# Altium project EBC2.PrjPCB
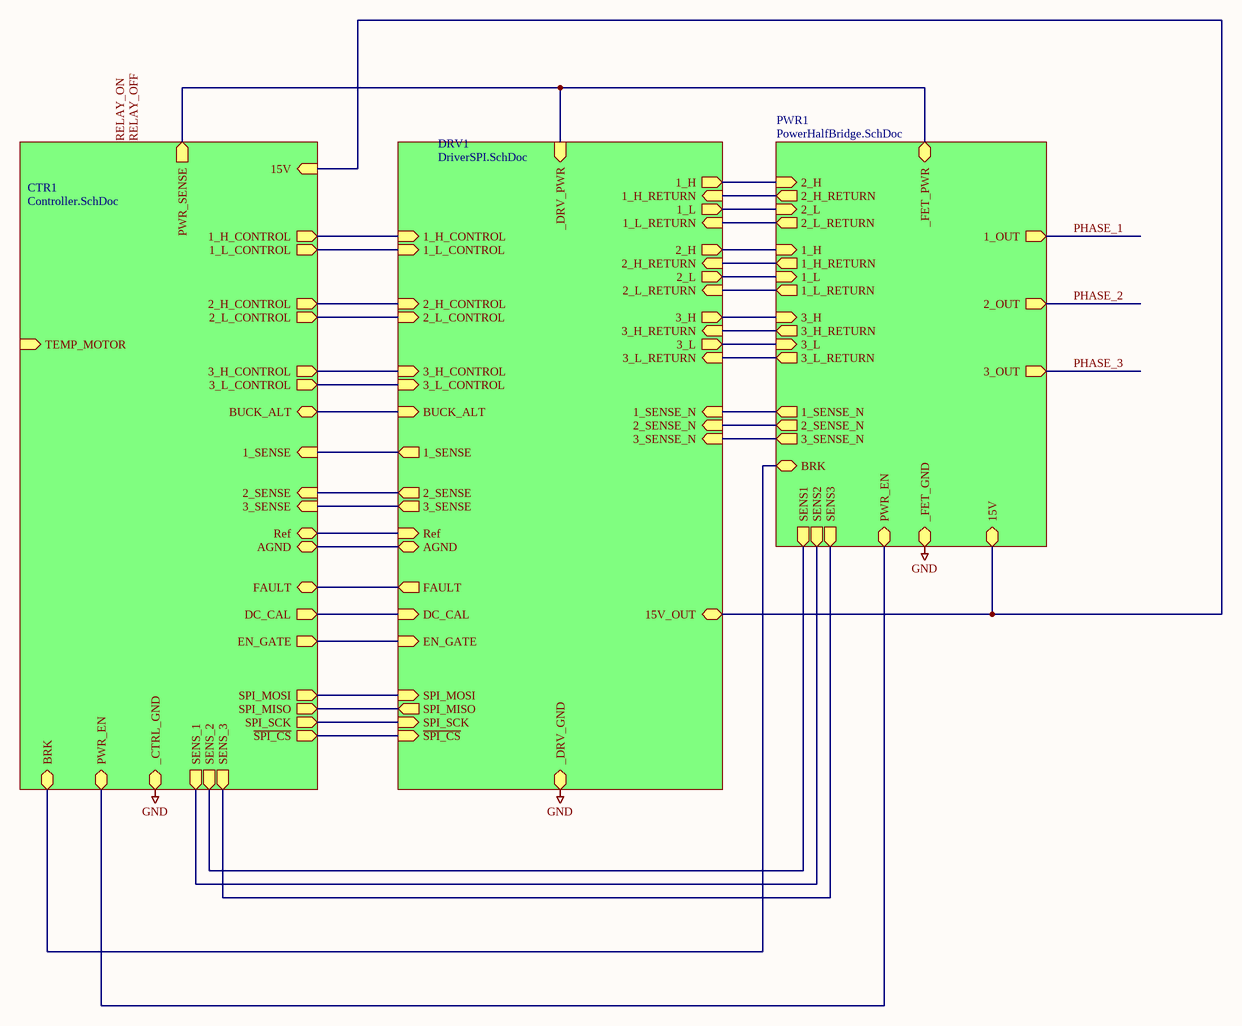
[diagram p0: Main.SchDoc]
4 sheets, 138 parts. Net scope: hierarchical (ports join the sheet entries above them; power ports are global).
Board file: EBC2.PcbDoc
Sheets:
  Main.SchDoc
    PWR1 = PowerHalfBridge.SchDoc
    DRV1 = DriverSPI.SchDoc
    CTR1 = Controller.SchDoc

## Sheet Main.SchDoc
size A3; PageSetup: Record=PageOptions|CenterHorizontal=True|CenterVertical=True|PrintScale=0.67|XCorrection=1.00|YCorrection=1.00|PrintKind=2|BorderSize=5000000|LeftOffset=0|BottomOffset=0|Orientation=2|PaperLength=2970|PaperWidth=2100|Scale=100|PaperSource=7|PrintQuality=300|MediaType=1|DitherType=2|PrintScaleMode=1|PaperKind=A4|PaperIndex=9; Scale: 1:1; DocumentType: Схема электрическая принципиальная; FirstReferrence: АБВГ.123456.001

### Sub-sheets
CTR1 = Controller.SchDoc: FAULT, 1_L_CONTROL (out), 2_L_CONTROL (out), 3_L_CONTROL (out), DC_CAL (out), SPI_SCK (out), PWR_SENSE (out), 3_H_CONTROL (out), 2_H_CONTROL (out), 1_H_CONTROL (out), SPI_MOSI (out), ~{SPI_CS} (out), 1_SENSE (in), 2_SENSE (in), 15V (in), EN_GATE (out), _CTRL_GND, Ref, AGND, SPI_MISO (out), SENS_1 (out), SENS_2 (out), SENS_3 (out), TEMP_MOTOR (in), BRK, 3_SENSE (in), BUCK_ALT, PWR_EN
DRV1 = DriverSPI.SchDoc: 2_H (out), 1_H (out), 3_H (out), 2_L (out), 1_L (out), 3_L (out), 2_SENSE_N (in), 1_SENSE_N (in), 3_SENSE_N (in), 2_H_RETURN (in), 2_L_RETURN (in), 1_H_RETURN (in), 3_H_RETURN (in), 1_L_RETURN (in), 3_L_RETURN (in), 2_H_CONTROL (in), 2_L_CONTROL (in), 1_H_CONTROL (in), 1_L_CONTROL (in), 3_H_CONTROL (in), 3_L_CONTROL (in), 1_SENSE (out), 2_SENSE (out), _DRV_PWR (in), _DRV_GND (bidir), Ref (in), AGND (bidir), 15V_OUT, FAULT (out), EN_GATE (in), DC_CAL (in), SPI_MOSI (in), SPI_MISO (out), ~{SPI_CS} (in), SPI_SCK (in), 3_SENSE (out), BUCK_ALT (in)
PWR1 = PowerHalfBridge.SchDoc: 1_H (in), 2_H (in), 3_H (in), 1_L (in), 2_L (in), 3_L (in), 1_SENSE_N (out), 2_SENSE_N (out), 3_SENSE_N (out), _FET_PWR, _FET_GND, 1_OUT (out), 2_OUT (out), 3_OUT (out), 1_H_RETURN (out), 1_L_RETURN (out), 2_H_RETURN (out), 3_H_RETURN (out), 2_L_RETURN (out), 3_L_RETURN (out), SENS1 (out), SENS2 (out), SENS3 (out), 15V, BRK, PWR_EN

### Nets
GND: sheet PWR1/_FET_GND, sheet DRV1/_DRV_GND, sheet CTR1/_CTRL_GND  [project net _CTRL_GND]
1_H_CONTROL: sheet DRV1/1_H_CONTROL, sheet CTR1/1_H_CONTROL
1_L_CONTROL: sheet DRV1/1_L_CONTROL, sheet CTR1/1_L_CONTROL
2_L_CONTROL: sheet DRV1/2_L_CONTROL, sheet CTR1/2_L_CONTROL
3_L_CONTROL: sheet DRV1/3_L_CONTROL, sheet CTR1/3_L_CONTROL
_AGND: sheet DRV1/AGND, sheet CTR1/AGND
_REF: sheet DRV1/Ref, sheet CTR1/Ref
BRK: sheet PWR1/BRK, sheet CTR1/BRK
BUCK: sheet PWR1/15V, sheet DRV1/15V_OUT, sheet CTR1/15V
EN_GATE: sheet DRV1/EN_GATE, sheet CTR1/EN_GATE
FAULT: sheet DRV1/FAULT, sheet CTR1/FAULT
PHASE_1: sheet PWR1/1_OUT, sheet PWR1/1_H_RETURN, sheet DRV1/2_H_RETURN
PHASE_2: sheet PWR1/2_OUT, sheet PWR1/2_H_RETURN, sheet DRV1/1_H_RETURN
PHASE_3: sheet PWR1/3_OUT, sheet PWR1/3_H_RETURN, sheet DRV1/3_H_RETURN
PWR_EN: sheet PWR1/PWR_EN, sheet CTR1/PWR_EN
~{SPI_CS}: sheet DRV1/~{SPI_CS}, sheet CTR1/~{SPI_CS}
SPI_MOSI: sheet DRV1/SPI_MOSI, sheet CTR1/SPI_MOSI
SPI_SCK: sheet DRV1/SPI_SCK, sheet CTR1/SPI_SCK
UH_P: sheet PWR1/1_H, sheet DRV1/2_H
UL_N: sheet PWR1/1_L_RETURN, sheet DRV1/2_L_RETURN
UL_P: sheet PWR1/1_L, sheet DRV1/2_L
VH_P: sheet PWR1/2_H, sheet DRV1/1_H
Vin: sheet PWR1/_FET_PWR, sheet DRV1/_DRV_PWR, sheet CTR1/PWR_SENSE
VL_N: sheet PWR1/2_L_RETURN, sheet DRV1/1_L_RETURN
VL_P: sheet PWR1/2_L, sheet DRV1/1_L
WH_P: sheet PWR1/3_H, sheet DRV1/3_H
WL_N: sheet PWR1/3_L_RETURN, sheet DRV1/3_L_RETURN
WL_P: sheet PWR1/3_L, sheet DRV1/3_L
NetC212_1: sheet DRV1/BUCK_ALT, sheet CTR1/BUCK_ALT
NetIC100_9: sheet PWR1/SENS2, sheet CTR1/SENS_1
NetIC100_10: sheet PWR1/SENS1, sheet CTR1/SENS_2
NetIC100_11: sheet PWR1/SENS3, sheet CTR1/SENS_3
NetIC100_14: sheet DRV1/3_SENSE, sheet CTR1/3_SENSE
NetIC100_15: sheet DRV1/2_SENSE, sheet CTR1/2_SENSE
NetIC100_16: sheet DRV1/1_SENSE, sheet CTR1/1_SENSE
NetIC200_12: sheet PWR1/1_SENSE_N, sheet DRV1/1_SENSE_N
NetIC200_13: sheet PWR1/2_SENSE_N, sheet DRV1/2_SENSE_N
NetIC200_22: sheet PWR1/3_SENSE_N, sheet DRV1/3_SENSE_N
NetIC200_29: sheet DRV1/SPI_MISO, sheet CTR1/SPI_MISO
NetIC200_34: sheet DRV1/DC_CAL, sheet CTR1/DC_CAL
NetIC200_39: sheet DRV1/2_H_CONTROL, sheet CTR1/2_H_CONTROL
NetIC200_41: sheet DRV1/3_H_CONTROL, sheet CTR1/3_H_CONTROL

### Notes on the sheet
- Labels drawn without touching a wire or pin: RELAY_OFF, RELAY_ON
- Title
- Size:
- Date:
- A3
- Number:
- Time:
- Revision:
- Sheet
- of
- File:

## Sheet PowerHalfBridge.SchDoc
size A3
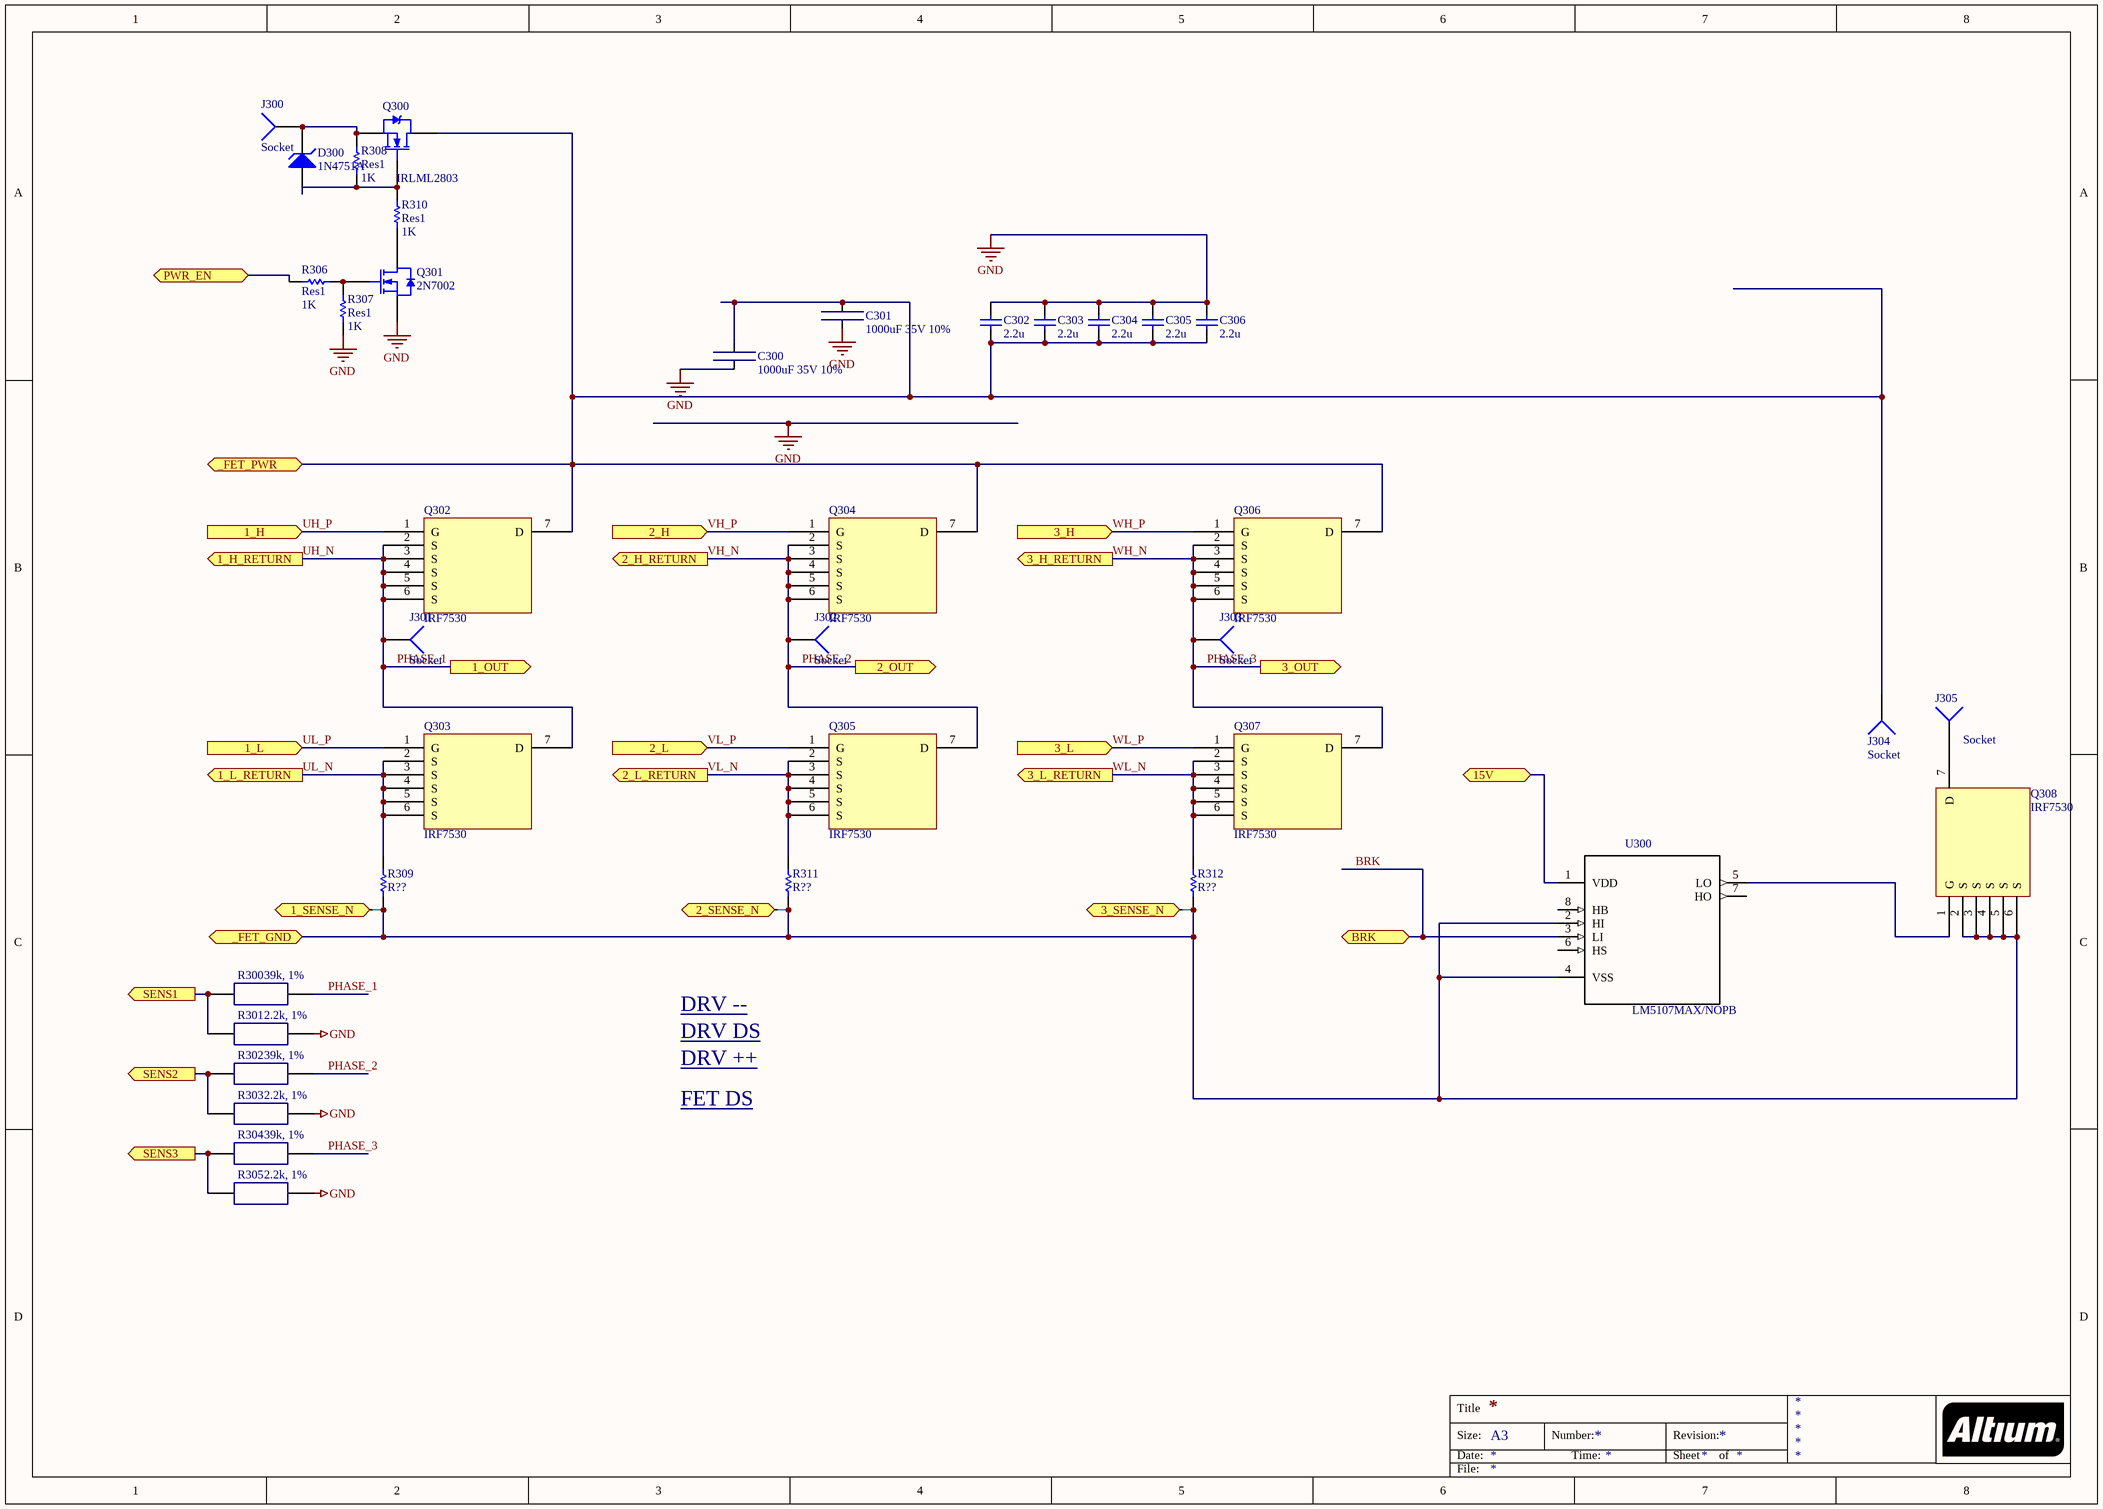
[diagram p1: PowerHalfBridge.SchDoc]

### Parts
C300  1000uF 35V 10%  [CAP_1mF_63V_SMD]
C301  1000uF 35V 10%  [CAP_1mF_63V_SMD]
C302  2.2u  [1210]
C303  2.2u  [1210]
C304  2.2u  [1210]
C305  2.2u  [1210]
C306  2.2u  [1210]
D300  1N4751A  [SOD80C]
J300  Socket  [PIN1]
J301  Socket  [PIN1]
J302  Socket  [PIN1]
J303  Socket  [PIN1]
J304  Socket  [PIN1]
J305  Socket  [PIN1]
NT300  NET_TIE  [NET_TIE_20mil]  (value not drawn)  (net tie, no BOM)
NT301  NET_TIE  [NET_TIE_20mil]  (value not drawn)  (net tie, no BOM)
NT302  NET_TIE  [NET_TIE_20mil]  (value not drawn)  (net tie, no BOM)
Q300  IRLML2803  [SOT-23]
Q301  2N7002  [SOT-23]
Q302  IRF7530  [D2PAK-7]
Q303  IRF7530  [D2PAK-7]
Q304  IRF7530  [D2PAK-7]
Q305  IRF7530  [D2PAK-7]
Q306  IRF7530  [D2PAK-7]
Q307  IRF7530  [D2PAK-7]
Q308  IRF7530  [D2PAK-7]
R300  39k, 1%  [0805x]
R301  2.2k, 1%  [0805x]
R302  39k, 1%  [0805x]
R303  2.2k, 1%  [0805x]
R304  39k, 1%  [0805x]
R305  2.2k, 1%  [0805x]
R306  Res1  value 1K  [0603x]
R307  Res1  value 1K  [0603x]
R308  Res1  value 1K  [0603x]
R309  value R??  [2512]  (hidden comment: Res1)
R310  Res1  value 1K  [0603x]
R311  value R??  [2512]  (hidden comment: Res1)
R312  value R??  [2512]  (hidden comment: Res1)
U300  LM5107MAX/NOPB  [SOIC127P620X175-8N]

### Ports
1_H (in), 1_H_RETURN (out), 1_L (in), 1_L_RETURN (out), 1_OUT (out), 1_SENSE_N (out), 2_H (in), 2_H_RETURN (out), 2_L (in), 2_L_RETURN (out), 2_OUT (out), 2_SENSE_N (out), 3_H (in), 3_H_RETURN (out), 3_L (in), 3_L_RETURN (out), 3_OUT (out), 3_SENSE_N (out), 15V, _FET_GND, _FET_PWR, BRK, PWR_EN, SENS1 (out), SENS2 (out), SENS3 (out)

### Nets
GND: C300.2 C301.1 C302.2 C303.2 C304.2 C305.2 C306.2 NT300.2 NT301.2 NT302.2 Q301.2(S) Q308.2(S) Q308.3(S) Q308.4(S) Q308.5(S) Q308.6(S) R301.2 R303.2 R305.2 R307.2 R309.1 R311.1 R312.1 U300.2(HI) U300.4(VSS) ; port _FET_GND  [project net _CTRL_GND]
BRK: U300.3(LI) ; port BRK
BUCK: U300.1(VDD) ; port 15V
PHASE_1: J301.1 Q302.2(S) Q302.3(S) Q302.4(S) Q302.5(S) Q302.6(S) Q303.7(D) R300.2 ; port 1_H_RETURN, port 1_OUT  [also labelled UH_N]
PHASE_2: J302.1 Q304.2(S) Q304.3(S) Q304.4(S) Q304.5(S) Q304.6(S) Q305.7(D) R302.2 ; port 2_H_RETURN, port 2_OUT  [also labelled VH_N]
PHASE_3: J303.1 Q306.2(S) Q306.3(S) Q306.4(S) Q306.5(S) Q306.6(S) Q307.7(D) R304.2 ; port 3_H_RETURN, port 3_OUT  [also labelled WH_N]
PWR_EN: R306.2 ; port PWR_EN
UH_P: Q302.1(G) ; port 1_H
UL_N: Q303.2(S) Q303.3(S) Q303.4(S) Q303.5(S) Q303.6(S) R309.2 ; port 1_L_RETURN
UL_P: Q303.1(G) ; port 1_L
VH_P: Q304.1(G) ; port 2_H
Vin: C300.1 C301.2 C302.1 C303.1 C304.1 C305.1 C306.1 J304.1 Q300.3(D) Q302.7(D) Q304.7(D) Q306.7(D) ; port _FET_PWR
VL_N: Q305.2(S) Q305.3(S) Q305.4(S) Q305.5(S) Q305.6(S) R311.2 ; port 2_L_RETURN
VL_P: Q305.1(G) ; port 2_L
WH_P: Q306.1(G) ; port 3_H
WL_N: Q307.2(S) Q307.3(S) Q307.4(S) Q307.5(S) Q307.6(S) R312.2 ; port 3_L_RETURN
WL_P: Q307.1(G) ; port 3_L
NetD300_1: D300.1(A) Q300.1(G) R308.1 R310.2
NetD300_2: D300.2(K) J300.1 Q300.2(S) R308.2
NetIC100_9: R302.1 R303.1 ; port SENS2
NetIC100_10: R300.1 R301.1 ; port SENS1
NetIC100_11: R304.1 R305.1 ; port SENS3
NetIC200_12: NT300.1 ; port 1_SENSE_N
NetIC200_13: NT301.1 ; port 2_SENSE_N
NetIC200_22: NT302.1 ; port 3_SENSE_N
NetJ305_1: J305.1 Q308.7(D)
NetQ301_1: Q301.1(G) R306.1 R307.1
NetQ301_3: Q301.3(D) R310.1
NetQ308_1: Q308.1(G) U300.5(LO)

Not connected (* = marked no-connect by the designer): U300 6(HS) 7(HO) 8(HB)

### Notes on the sheet
- DRV DS <http://www.ti.com/lit/ds/symlink/drv8323r.pdf>
- DRV -- <http://www.ti.com/product/drv8323r>
- DRV ++ <http://www.ti.com/tool/tida-00774>
- FET DS <https://www.infineon.com/dgdl/Infineon-IPB039N10N3G-DS-v02_03-en.pdf?fileId=db3a30431ce5fb52011d1ed1fd3915e0>
- Title
- Size:
- Date:
- A3
- Number:
- Time:
- Revision:
- Sheet
- of
- File:

### Library data of the parts
C300 C301 = Ceramic Chip Capacitor: Value: CAP CER 0.022UF 50V X7R 0402; Order Number: GRM155R71H223KA12D; Distributor: Murata Electronics; Package: 0402
C302-C306 = Cap: Capacitor; Value: 100pF; Published: 8-Jun-2000; LatestRevisionDate: 17-Jul-2002; LatestRevisionNote: Re-released for DXP Platform.; PackageReference: RAD-0.3; Publisher: Altium Limited; PackageDescription: Radial Cap, Thru-Hole; 2 Leads; 0.3 in Pin Spacing
D300 = 1N4751A: 1W Zener Diode; Published: 8-Jun-2000; LatestRevisionDate: 17-Jul-2002; LatestRevisionNote: Re-released for DXP Platform.; DatasheetDocument: REV. H; PackageReference: DO-41; Publisher: Altium Limited; Code_JEDEC: DO-204-AL; ComponentLink1Description: Manufacturer Link; ComponentLink1URL: http://www.vishay.com/; ComponentLink2Description: Datasheet; ComponentLink2URL: http://www.vishay.com/docs/85816/85816.pdf
NT300-NT302 = Net tie
Q300 = IRLML2803: HEXFET Power MOSFET; Published: 8-Jun-2000; LatestRevisionDate: 20-Nov-2009; LatestRevisionNote: IPC-7351 Footprint Added.; DatasheetVersion: Aug-1997; PackageReference: SOT-23; Publisher: Altium Limited; PackageDescription: 3-Pin SOT-23 Package 0.95 mm Pitch, 2.3 mm Lead Span; ComponentLink1Description: Manufacturer Link; ComponentLink1URL: http://www.irf.com/; ComponentLink2Description: Datasheet; ComponentLink2URL: http://www.irf.com/product-info/datasheets/data/irlml2803.pdf
Q301 = 2N7002: N-channel Enhancement Mode Field-effect Transistor; Published: 17-Sep-2003; LatestRevisionDate: 12-Dec-2006; LatestRevisionNote: IPC-7351 Footprint Added.; DatasheetVersion: 27-Jul-2000; PackageVersion: May-1999; PackageReference: SOT23; Publisher: Altium Limited; PackageDescription: 3-Pin SOT-23 Package 0.95 mm Pitch, 2.3 mm Lead Span; ComponentLink1Description: Manufacturer Link; ComponentLink1URL: http://www.semiconductors.philips.com/; ComponentLink2Description: Datasheet; ComponentLink2URL: http://www.semiconductors.philips.com/acrobat/datasheets/2N7002_4.pdf
R300 R302 R304 = SMD: Order Number: ERJ-3EKF3902V; Value: 39k, 1%; Package: RESC1608X05N(0603); Distributor: Panasonic
R301 R303 R305 = SMD: Order Number: ERJ-3EKF2201V; Value: 2.2k, 1%; Package: RESC1608X05N(0603); Distributor: Panasonic
R306-R312 = Res1: Resistor; Published: 8-Jun-2000; LatestRevisionDate: 17-Jul-2002; LatestRevisionNote: Re-released for DXP Platform.; PackageReference: AXIAL-0.3; Publisher: Altium Limited; PackageDescription: Axial Device, Thru-Hole; 2 Leads; 0.3 in Pin Spacing
U300 = LM5107MAX/NOPB: IC DVR HALF-BRIDGE HV 8-SOIC; MF: Texas Instruments; Availability: Good; Package: SOIC-8 Texas Instruments; MP: LM5107MAX/NOPB; Price: 1.38 USD; Value: *
J300-J305 = Socket: LatestRevisionDate: 17-Jul-2002; LatestRevisionNote: Re-released for DXP Platform.; Publisher: Altium Limited

## Sheet DriverSPI.SchDoc
size A3
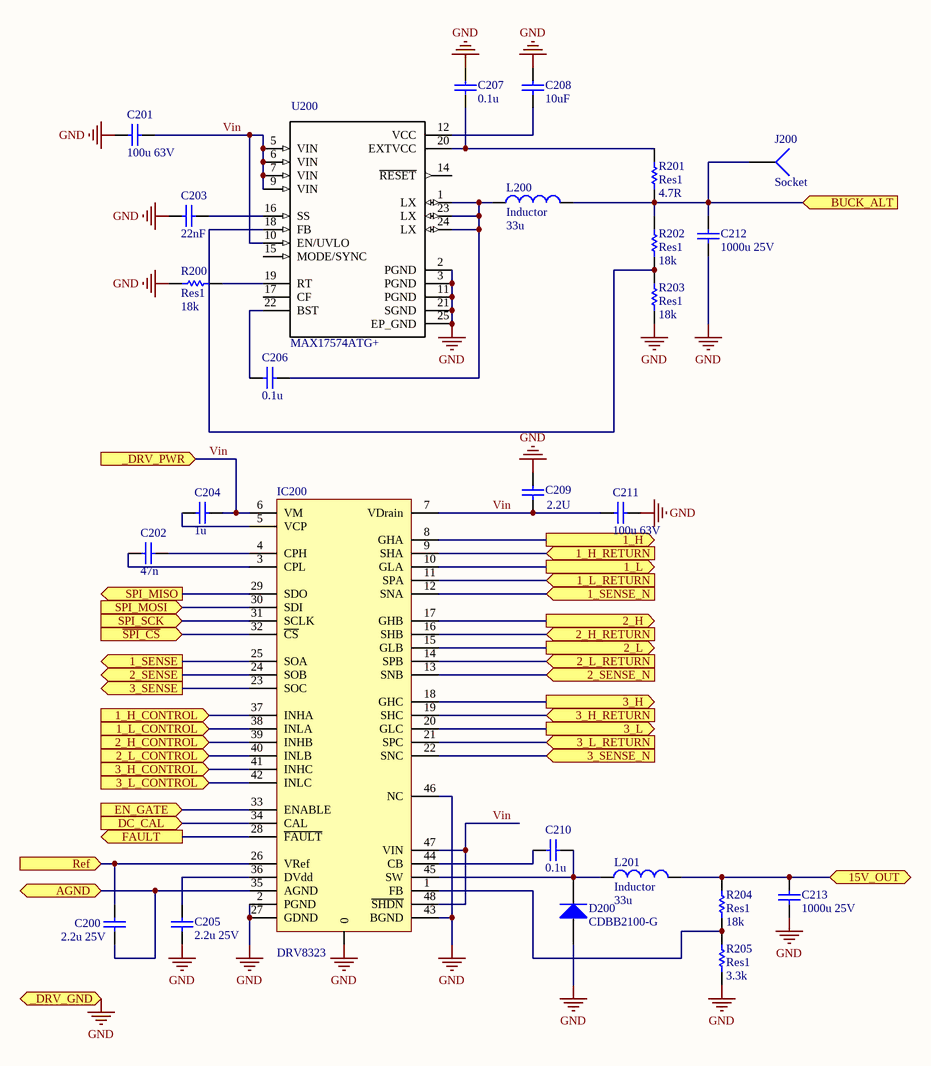
[diagram p2: DriverSPI.SchDoc]

### Parts
C200  2.2u 25V  [1206x]
C201  100u 63V  [CAP_ELEC_10mm]
C202  47n  [0603x]
C203  22nF  [0603x]
C204  1u  [0805x]
C205  2.2u 25V  [1206x]
C206  0.1u  [0603x]
C207  0.1u  [0603x]
C208  10uF  [1206x]
C209  2.2U  [1210]
C210  0.1u  [0603x]
C211  100u 63V  [CAP_ELEC_10mm]
C212  1000u 25V  [CAP_ELEC_10mm]
C213  1000u 25V  [CAP_ELEC_10mm]
D200  CDBB2100-G  [SMB_real]
IC200  DRV8323  [PWQFN-48]
J200  Socket  [PIN1]
L200  Inductor  value 33u  [DR74]
L201  Inductor  value 33u  [DR74]
R200  Res1  value 18k  [0603x]
R201  Res1  value 4.7R  [0603x]
R202  Res1  value 18k  [0603x]
R203  Res1  value 18k  [0603x]
R204  Res1  value 18k  [0603x]
R205  Res1  value 3.3k  [0603x]
U200  MAX17574ATG+  [QFN50P500X400X80-25N]

### Ports
1_H (out), 1_H_CONTROL (in), 1_H_RETURN (in), 1_L (out), 1_L_CONTROL (in), 1_L_RETURN (in), 1_SENSE (out), 1_SENSE_N (in), 2_H (out), 2_H_CONTROL (in), 2_H_RETURN (in), 2_L (out), 2_L_CONTROL (in), 2_L_RETURN (in), 2_SENSE (out), 2_SENSE_N (in), 3_H (out), 3_H_CONTROL (in), 3_H_RETURN (in), 3_L (out), 3_L_CONTROL (in), 3_L_RETURN (in), 3_SENSE (out), 3_SENSE_N (in), 15V_OUT, _DRV_GND (bidir), _DRV_PWR (in), AGND (bidir), BUCK_ALT (in), DC_CAL (in), EN_GATE (in), FAULT (out), Ref (in), SPI_MISO (out), SPI_MOSI (in), SPI_SCK (in), ~{SPI_CS} (in)

### Nets
GND: C201.2 C203.1 C205.1 C207.2 C208.2 C209.2 C211.1 C212.2 C213.2 D200.1(A) IC200.0 IC200.2(PGND) IC200.27(GDND) IC200.43(BGND) IC200.46(NC) R200.2 R203.1 R205.1 U200.2(PGND) U200.3(PGND) U200.11(PGND) U200.21(SGND) U200.25(EP_GND) ; port _DRV_GND  [project net _CTRL_GND]
1_H_CONTROL: IC200.37(INHA) ; port 1_H_CONTROL
1_L_CONTROL: IC200.38(INLA) ; port 1_L_CONTROL
2_L_CONTROL: IC200.40(INLB) ; port 2_L_CONTROL
3_L_CONTROL: IC200.42(INLC) ; port 3_L_CONTROL
_AGND: C200.1 IC200.35(AGND) ; port AGND
_REF: C200.2 IC200.26(VRef) ; port Ref
BUCK: C213.1 L201.2 R204.2 ; port 15V_OUT
EN_GATE: IC200.33(ENABLE) ; port EN_GATE
FAULT: IC200.28(~{FAULT}) ; port FAULT
PHASE_1: IC200.16(SHB) ; port 2_H_RETURN
PHASE_2: IC200.9(SHA) ; port 1_H_RETURN
PHASE_3: IC200.19(SHC) ; port 3_H_RETURN
~{SPI_CS}: IC200.32(~{CS}) ; port ~{SPI_CS}
SPI_MOSI: IC200.30(SDI) ; port SPI_MOSI
SPI_SCK: IC200.31(SCLK) ; port SPI_SCK
UH_P: IC200.17(GHB) ; port 2_H
UL_N: IC200.14(SPB) ; port 2_L_RETURN
UL_P: IC200.15(GLB) ; port 2_L
VH_P: IC200.8(GHA) ; port 1_H
Vin: C201.1 C204.2 C209.1 C211.2 IC200.6(VM) IC200.7(VDrain) IC200.47(VIN) IC200.48(~{SHDN}) U200.5(VIN) U200.6(VIN) U200.7(VIN) U200.9(VIN) U200.10(EN/UVLO) ; port _DRV_PWR
VL_N: IC200.11(SPA) ; port 1_L_RETURN
VL_P: IC200.10(GLA) ; port 1_L
WH_P: IC200.18(GHC) ; port 3_H
WL_N: IC200.21(SPC) ; port 3_L_RETURN
WL_P: IC200.20(GLC) ; port 3_L
NetC202_1: C202.1 IC200.3(CPL)
NetC202_2: C202.2 IC200.4(CPH)
NetC203_2: C203.2 U200.16(SS)
NetC204_1: C204.1 IC200.5(VCP)
NetC205_2: C205.2 IC200.36(DVdd)
NetC206_1: C206.1 U200.22(BST)
NetC206_2: C206.2 L200.1 U200.1(LX) U200.23(LX) U200.24(LX)
NetC207_1: C207.1 R201.1 U200.20(EXTVCC)
NetC208_1: C208.1 U200.12(VCC)
NetC210_1: C210.1 IC200.44(CB)
NetC210_2: C210.2 D200.2(K) IC200.45(SW) L201.1
NetC212_1: C212.1 J200.1 L200.2 R201.2 R202.2 ; port BUCK_ALT
NetIC100_14: IC200.23(SOC) ; port 3_SENSE
NetIC100_15: IC200.24(SOB) ; port 2_SENSE
NetIC100_16: IC200.25(SOA) ; port 1_SENSE
NetIC200_1: IC200.1(FB) R204.1 R205.2
NetIC200_12: IC200.12(SNA) ; port 1_SENSE_N
NetIC200_13: IC200.13(SNB) ; port 2_SENSE_N
NetIC200_22: IC200.22(SNC) ; port 3_SENSE_N
NetIC200_29: IC200.29(SDO) ; port SPI_MISO
NetIC200_34: IC200.34(CAL) ; port DC_CAL
NetIC200_39: IC200.39(INHB) ; port 2_H_CONTROL
NetIC200_41: IC200.41(INHC) ; port 3_H_CONTROL
NetR200_1: R200.1 U200.19(RT)
NetR202_1: R202.1 R203.2 U200.18(FB)

Not connected (* = marked no-connect by the designer): U200 14(~{RESET}) 15(MODE/SYNC) 17(CF)

### Notes on the sheet
- Title
- Size:
- Date:
- A3
- Number:
- Time:
- Revision:
- Sheet
- of
- File:

### Library data of the parts
C200-C213 = Cap: Capacitor; Value: 100pF; Published: 8-Jun-2000; LatestRevisionDate: 17-Jul-2002; LatestRevisionNote: Re-released for DXP Platform.; PackageReference: RAD-0.3; Publisher: Altium Limited; PackageDescription: Radial Cap, Thru-Hole; 2 Leads; 0.3 in Pin Spacing
D200 = Diode: Default Diode; Published: 8-Jun-2000; LatestRevisionDate: 17-Jul-2002; LatestRevisionNote: Re-released for DXP Platform.; PackageVersion: Sep-1996; PackageReference: SMC; Publisher: Altium Limited; PackageDescription: DO-214-AB/SMC; 2 C-Bend Leads; Body 7.9 x 5.9 mm, inc. leads (LxW); Code_JEDEC: DO-214-AB
L200 L201 = Inductor: Code_IEC: 1005; Published: 8-Jun-2000; LatestRevisionDate: 29-May-2009; LatestRevisionNote: IPC-7351 Footprint Added.; PackageReference: 0402-A; Publisher: Altium Limited; PackageDescription: Chip Inductor; Code_JEITA: 0402
R200-R205 = Res1: Resistor; Published: 8-Jun-2000; LatestRevisionDate: 17-Jul-2002; LatestRevisionNote: Re-released for DXP Platform.; PackageReference: AXIAL-0.3; Publisher: Altium Limited; PackageDescription: Axial Device, Thru-Hole; 2 Leads; 0.3 in Pin Spacing
U200 = MAX17574ATG+: IC REG BUCK ADJ 3A SYNC 24TQFN; MF: Maxim Integrated; MP: MAX17574ATG+; Package: TQFN-24 Maxim Integrated; Digi-Key_Part_Number: MAX17574ATG+-ND; Digi-Key_Purchase_URL: https://www.digikey.com/product-detail/en/maxim-integrated/MAX17574ATG-/MAX17574ATG--ND/6579157?WT.z_cid=ref_snapeda&utm_source=snapeda&utm_medium=aggregator&utm_campaign=buynow; Value: *
J200 = Socket: LatestRevisionDate: 17-Jul-2002; LatestRevisionNote: Re-released for DXP Platform.; Publisher: Altium Limited

## Sheet Controller.SchDoc
size A2
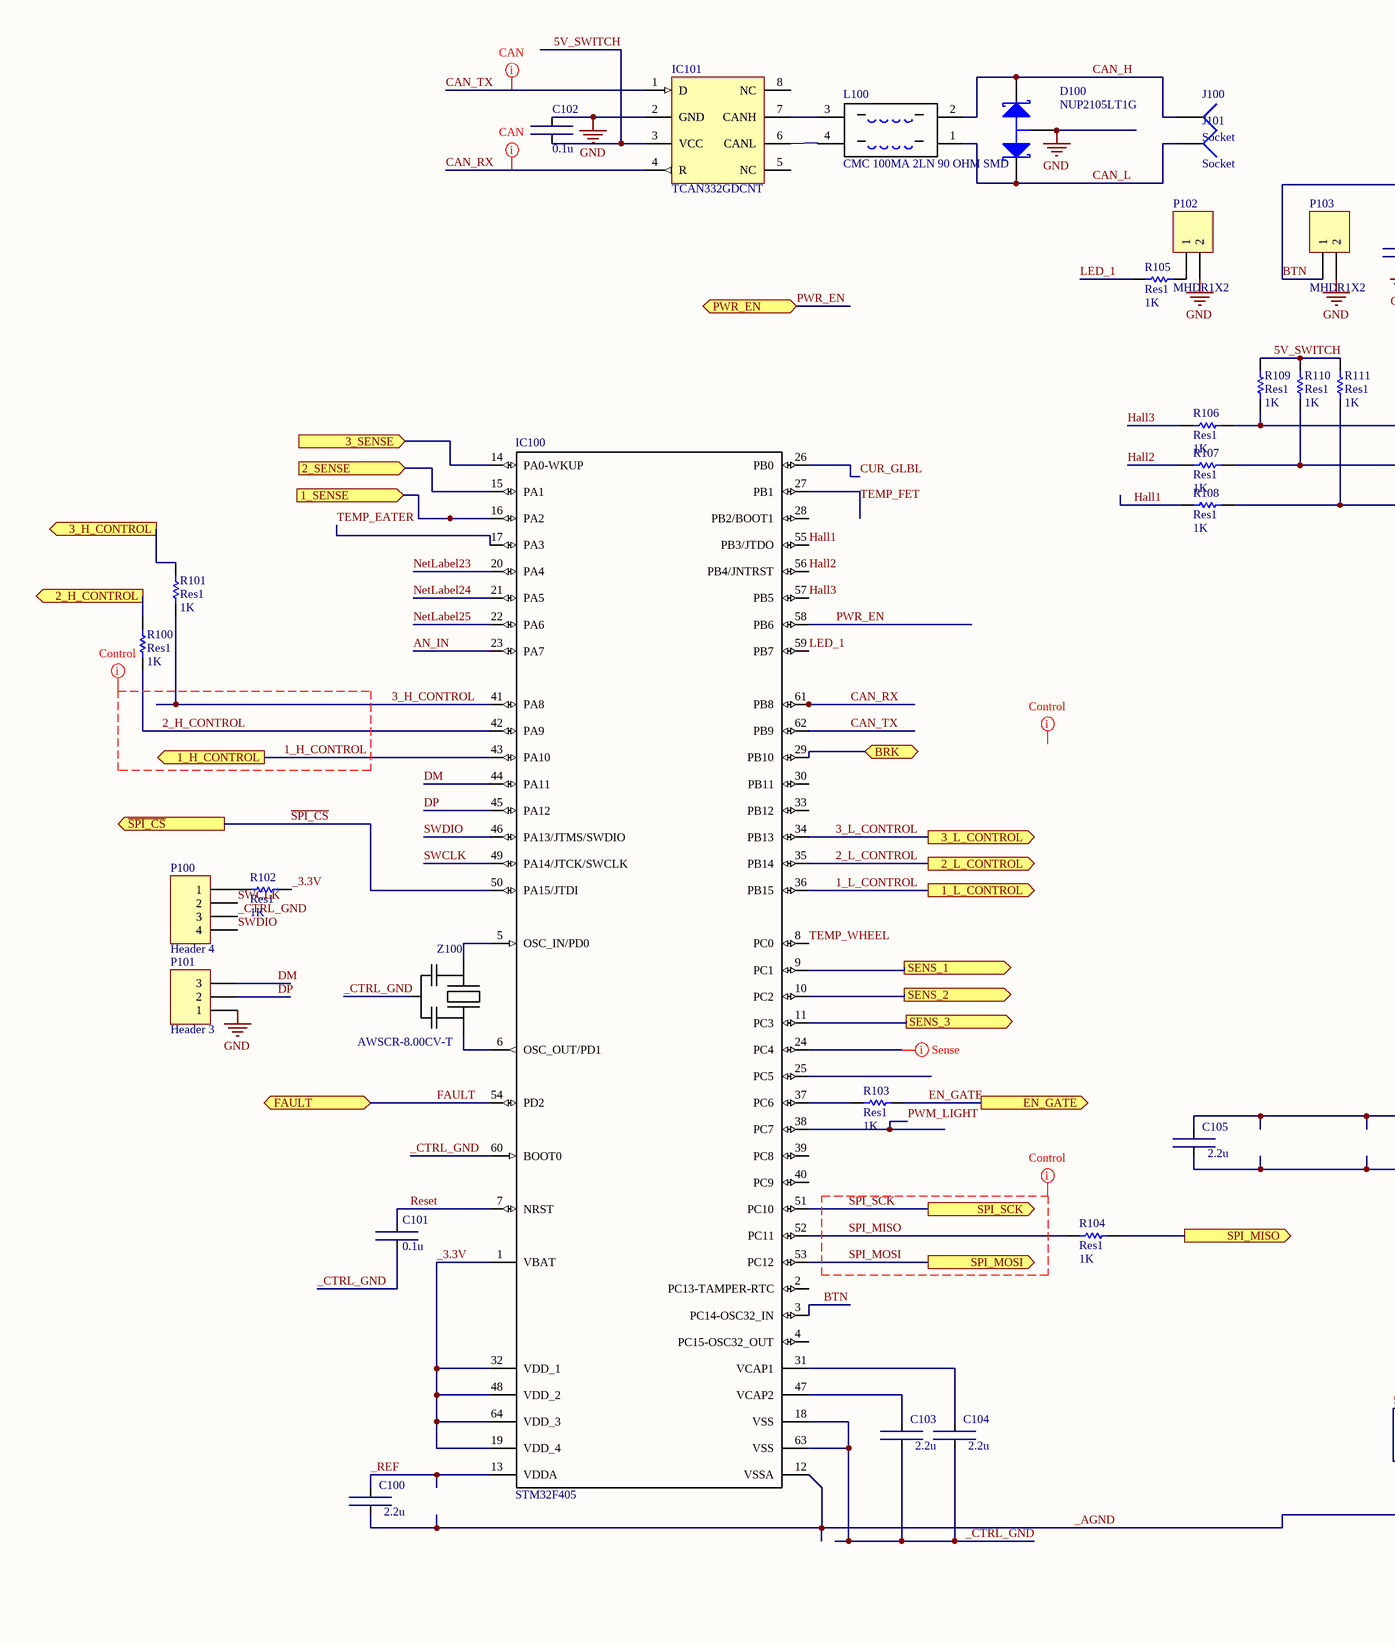
[diagram p3: Controller.SchDoc, left]
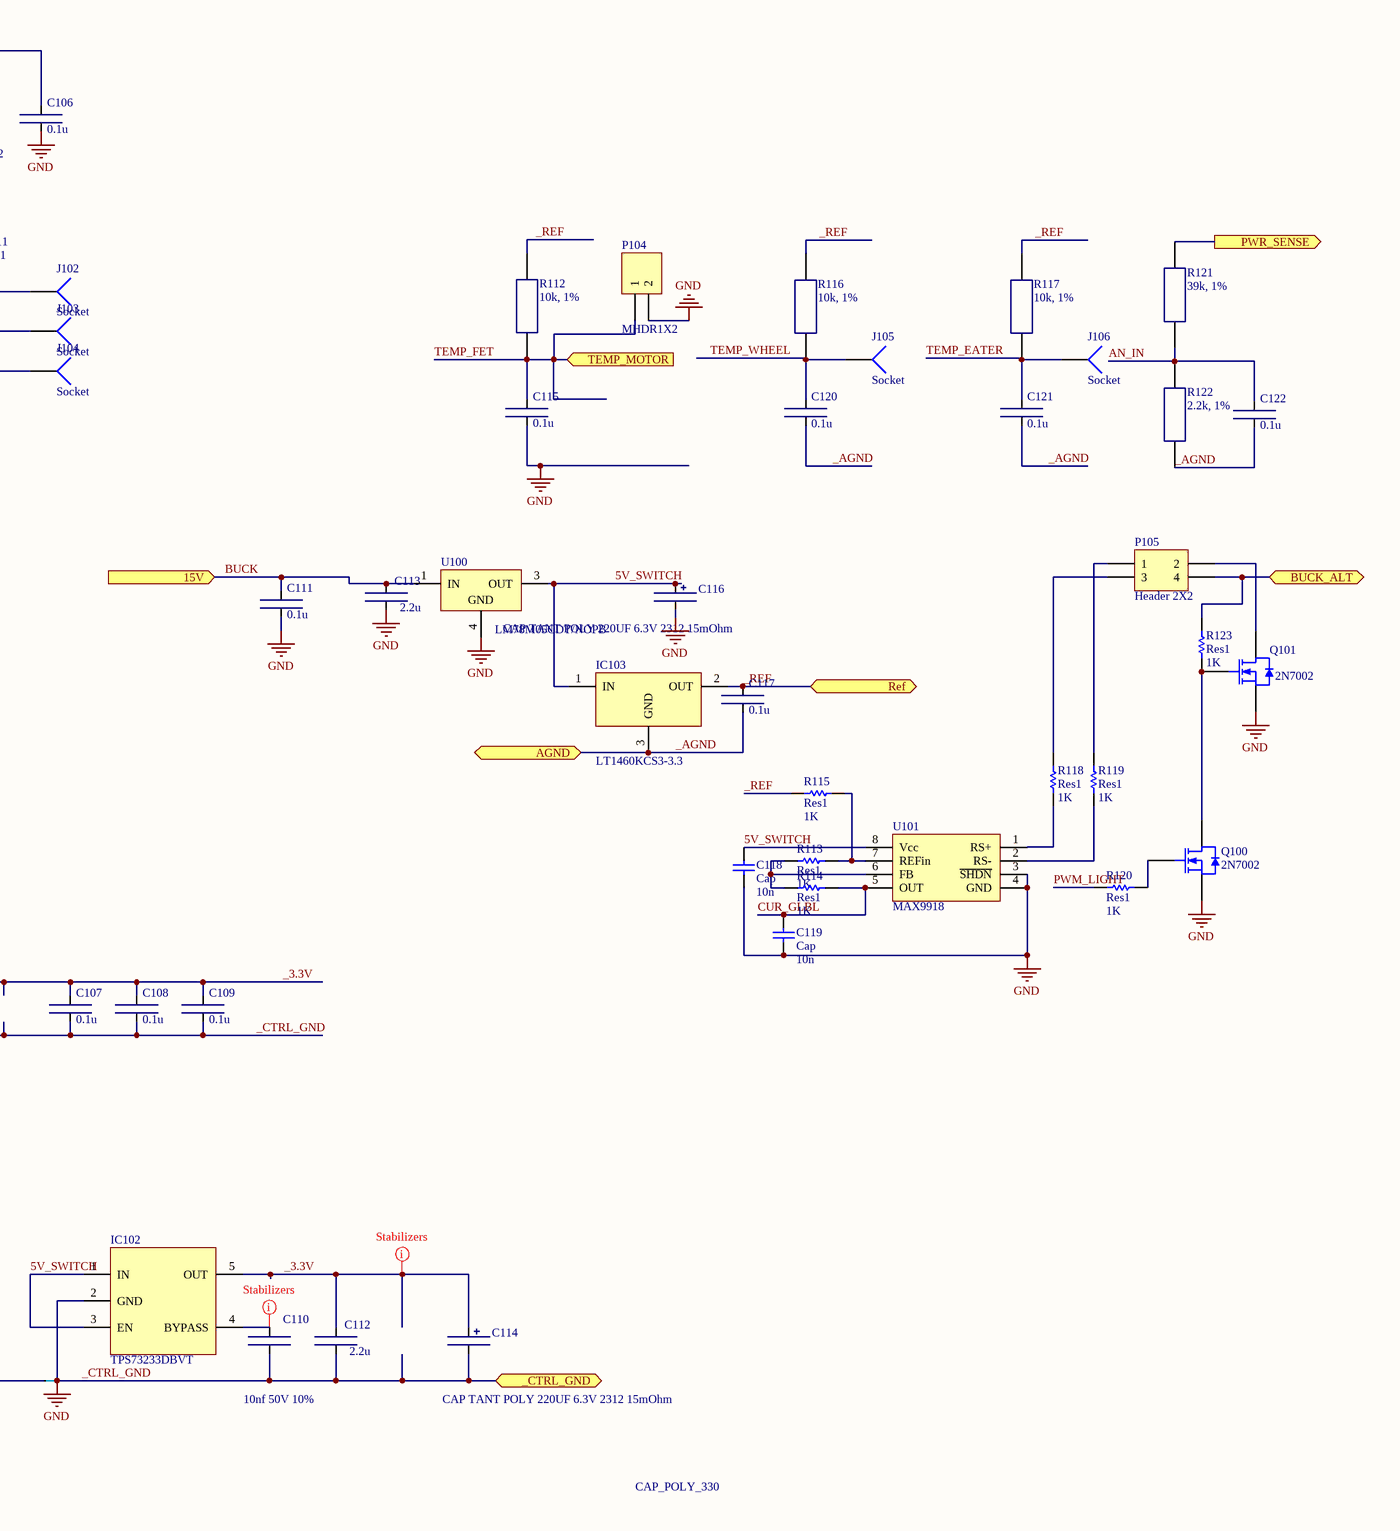
[diagram p4: Controller.SchDoc, right]

### Parts
C100  2.2u  [0603x]
C101  0.1u  [CAPC1608X08N(0603)]
C102  0.1u  [0603x]
C103  2.2u  [CAPC1608X08N(0603)]
C104  2.2u  [0603x]
C105  2.2u  [CAPC1608X08N(0603)]
C106  0.1u  [0603x]
C107  0.1u  [0603x]
C108  0.1u  [CAPC1608X08N(0603)]
C109  0.1u  [CAPC1608X08N(0603)]
C110  10nf 50V 10%  [0603x]
C111  0.1u  [ERA-0603]
C112  2.2u  [0603x]
C113  2.2u  [0603x]
C114  CAP TANT POLY 220UF 6.3V 2312 15mOhm  [CAP_POLY_330]
C115  0.1u  [0603x]
C116  CAP TANT POLY 220UF 6.3V 2312 15mOhm  [CAP_POLY_330]
C117  0.1u  [0603x]
C118  Cap  value 10n  [0603x]
C119  Cap  value 10n  [0603x]
C120  0.1u  [0603x]
C121  0.1u  [0603x]
C122  0.1u  [0603x]
D100  NUP2105LT1G  [SOT23_N]
IC100  STM32F405  [LQFP64_L]
IC101  TCAN332GDCNT  [SOT23-8_L]
IC102  TPS73233DBVT  [SOT23-5_L]
IC103  LT1460KCS3-3.3  [SOT-23]
J100  Socket  [PIN1]
J101  Socket  [PIN1]
J102  Socket  [PIN1]
J103  Socket  [PIN1]
J104  Socket  [PIN1]
J105  Socket  [PIN1]
J106  Socket  [PIN1]
L100  CMC 100MA 2LN 90 OHM SMD  [Choke_smd]
NT100  NET_TIE  [NET_TIE_20mil]  (value not drawn)  (net tie, no BOM)
P100  Header 4  [MHDR1X4]
P101  Header 3  [HDR1X3]
P102  MHDR1X2  [MHDR1X2]
P103  MHDR1X2  [MHDR1X2]
P104  MHDR1X2  [MHDR1X2]
P105  Header 2X2  [HDR2X2]
Q100  2N7002  [SOT-23]
Q101  2N7002  [SOT-23]
R100  Res1  value 1K  [0603x]
R101  Res1  value 1K  [0805x]
R102  Res1  value 1K  [0603x]
R103  Res1  value 1K  [1206x]
R104  Res1  value 1K  [0603x]
R105  Res1  value 1K  [0603x]
R106  Res1  value 1K  [0603x]
R107  Res1  value 1K  [0603x]
R108  Res1  value 1K  [0603x]
R109  Res1  value 1K  [0603x]
R110  Res1  value 1K  [0603x]
R111  Res1  value 1K  [0603x]
R112  10k, 1%  [1206x]
R113  Res1  value 1K  [0603x]
R114  Res1  value 1K  [0603x]
R115  Res1  value 1K  [0603x]
R116  10k, 1%  [0603x]
R117  10k, 1%  [0603x]
R118  Res1  value 1K  [0603x]
R119  Res1  value 1K  [0603x]
R120  Res1  value 1K  [0603x]
R121  39k, 1%  [1206x]
R122  2.2k, 1%  [0603x]
R123  Res1  value 1K  [0603x]
U100  LM78M05CDT/NOPB  [TD03B_N]
U101  MAX9918  [SO8_M]
Z100  AWSCR-8.00CV-T  [CRYSTAL_CERAMIC]

### Ports
1_H_CONTROL (out), 1_L_CONTROL (out), 1_SENSE (in), 2_H_CONTROL (out), 2_L_CONTROL (out), 2_SENSE (in), 3_H_CONTROL (out), 3_L_CONTROL (out), 3_SENSE (in), 15V (in), _CTRL_GND, AGND, BRK, BUCK_ALT, EN_GATE (out), FAULT, PWR_EN, PWR_SENSE (out), Ref, SENS_1 (out), SENS_2 (out), SENS_3 (out), SPI_MISO (out), SPI_MOSI (out), SPI_SCK (out), TEMP_MOTOR (in), ~{SPI_CS} (out)

### Nets
_CTRL_GND: C101.2 C102.1 C103.2 C104.2 C105.2 C106.2 C107.2 C108.2 C109.2 C110.2 C111.2 C112.2 C113.2 C114.2 C115.2 C116.2 C118.2 C119.2 D100.3(A) IC100.18(VSS) IC100.60(BOOT0) IC100.63(VSS) IC101.2(GND) IC102.2(GND) NT100.2 P100.3 P101.1 P102.2 P103.2 P104.2 Q100.2(S) Q101.2(S) U100.4(GND) U101.3(~{SHDN}) U101.4(GND) Z100.2(GND) ; port _CTRL_GND  [also labelled GND]
1_H_CONTROL: IC100.43(PA10) ; port 1_H_CONTROL
1_L_CONTROL: IC100.36(PB15) ; port 1_L_CONTROL
2_H_CONTROL: IC100.42(PA9) R100.2
2_L_CONTROL: IC100.35(PB14) ; port 2_L_CONTROL
3_H_CONTROL: IC100.41(PA8) R101.2
3_L_CONTROL: IC100.34(PB13) ; port 3_L_CONTROL
5V_SWITCH: C102.2 C116.1 C118.1 IC101.3(VCC) IC102.1(IN) IC102.3(EN) IC103.1(IN) R109.2 R110.2 R111.2 U100.3(OUT) U101.8(Vcc)
_3.3V: C105.1 C107.1 C108.1 C109.1 C112.1 C114.1 IC100.1(VBAT) IC100.19(VDD_4) IC100.32(VDD_1) IC100.48(VDD_2) IC100.64(VDD_3) IC102.5(OUT) R102.2
_AGND: C100.2 C117.2 C120.2 C121.2 C122.2 IC100.12(VSSA) IC103.3(GND) NT100.1 R122.2 ; port AGND
_REF: C100.1 C117.1 IC100.13(VDDA) IC103.2(OUT) R112.1 R115.2 R116.1 R117.1 ; port Ref
AN_IN: C122.1 IC100.23(PA7) R121.2 R122.1
BRK: IC100.29(PB10) ; port BRK
BTN: C106.1 IC100.3(PC14-OSC32_IN) P103.1
BUCK: C111.1 C113.1 U100.1(IN) ; port 15V
CAN_H: D100.1(K1) J100.1 L100.2
CAN_L: D100.2(K2) J101.1 L100.1
CAN_RX: IC100.61(PB8) IC101.4(R)
CAN_TX: IC100.62(PB9) IC101.1(D)
CUR_GLBL: C119.1 IC100.26(PB0) R114.1 U101.5(OUT)
DM: IC100.44(PA11) P101.3
DP: IC100.45(PA12) P101.2
EN_GATE: R103.1 ; port EN_GATE
FAULT: IC100.54(PD2) ; port FAULT
Hall1: IC100.55(PB3/JTDO) R108.1
Hall2: IC100.56(PB4/JNTRST) R107.1
Hall3: IC100.57(PB5) R106.1
LED_1: IC100.59(PB7) R105.1
NetLabel23: IC100.20(PA4)
NetLabel24: IC100.21(PA5)
NetLabel25: IC100.22(PA6)
PWM_LIGHT: IC100.38(PC7) R120.1
PWR_EN: IC100.58(PB6) ; port PWR_EN
Reset: C101.1 IC100.7(NRST)
~{SPI_CS}: IC100.50(PA15/JTDI) ; port ~{SPI_CS}
SPI_MISO: IC100.52(PC11) R104.2
SPI_MOSI: IC100.53(PC12) ; port SPI_MOSI
SPI_SCK: IC100.51(PC10) ; port SPI_SCK
SWCLK: IC100.49(PA14/JTCK/SWCLK) P100.2
SWDIO: IC100.46(PA13/JTMS/SWDIO) P100.4
TEMP_EATER: C121.1 IC100.17(PA3) J106.1 R117.2
TEMP_FET: C115.1 IC100.27(PB1) P104.1 R112.2 ; port TEMP_MOTOR
TEMP_WHEEL: C120.1 IC100.8(PC0) J105.1 R116.2
Vin: R121.1 ; port PWR_SENSE
NetC103_1: C103.1 IC100.47(VCAP2)
NetC104_1: C104.1 IC100.31(VCAP1)
NetC110_1: C110.1 IC102.4(BYPASS)
NetC212_1: P105.4 R123.1 ; port BUCK_ALT
NetIC100_5: IC100.5(OSC_IN/PD0) Z100.1(X1)
NetIC100_6: IC100.6(OSC_OUT/PD1) Z100.3(X2)
NetIC100_9: IC100.9(PC1) ; port SENS_1
NetIC100_10: IC100.10(PC2) ; port SENS_2
NetIC100_11: IC100.11(PC3) ; port SENS_3
NetIC100_14: IC100.14(PA0-WKUP) ; port 3_SENSE
NetIC100_15: IC100.15(PA1) ; port 2_SENSE
NetIC100_16: IC100.16(PA2) ; port 1_SENSE
NetIC100_37: IC100.37(PC6) R103.2
NetIC101_6: IC101.6(CANL) L100.4
NetIC101_7: IC101.7(CANH) L100.3
NetIC200_29: R104.1 ; port SPI_MISO
NetIC200_39: R100.1 ; port 2_H_CONTROL
NetIC200_41: R101.1 ; port 3_H_CONTROL
NetJ102_1: J102.1 R106.2 R109.1
NetJ103_1: J103.1 R107.2 R110.1
NetJ104_1: J104.1 R108.2 R111.1
NetP100_1: P100.1 R102.1
NetP102_1: P102.1 R105.2
NetP105_1: P105.1 R119.1
NetP105_2: P105.2 Q101.3(D)
NetP105_3: P105.3 R118.1
NetQ100_1: Q100.1(G) R120.2
NetQ100_3: Q100.3(D) Q101.1(G) R123.2
NetR113_1: R113.1 R115.1 U101.7(REFin)
NetR113_2: R113.2 R114.2 U101.6(FB)
NetR118_2: R118.2 U101.1(RS+)
NetR119_2: R119.2 U101.2(RS-)

Not connected (* = marked no-connect by the designer): IC100 2(PC13-TAMPER-RTC) 4(PC15-OSC32_OUT) 24(PC4) 25(PC5) 28(PB2/BOOT1) 30(PB11) 33(PB12) 39(PC8) 40(PC9); IC101 5(NC) 8(NC)

### Layout directives
net class Stabilizers: _3.3V, NetC110_1
net class Control: 1_H_CONTROL, 2_H_CONTROL, (no net found under the mark), SPI_MISO, SPI_MOSI, SPI_SCK
net class Sense: NetIC100_24
net class CAN: CAN_RX, CAN_TX

### Notes on the sheet
- CAP_POLY_330
- Title
- Size:
- Date:
- File:
- A2
- Number:
- Time:
- Revision:
- Sheet
- of

### Library data of the parts
C100 C103-C105 C112 C113 = Ceramic Chip Capacitor: Value: CAP CER 2.2UF 25V X5R 0603; Order Number: GRM188R61E225KA12D; Distributor: Murata Electronics; Package: CAPC1608X08N(0603)
C101 C102 C106-C109 C111 C115 C117 C120-C122 = Ceramic Chip Capacitor: Value: CAP CER 0.1UF 50V X7R 0603; Order Number: 06035C104KAT2A; Distributor: AVX Corporation
  C101 C102 C106 C111 C115 C117 C120-C122: Package: 0603
  C107-C109: Package: CAPC1608X08N(0603)
C110 = Ceramic Chip Capacitor: Value: CAP CER 10000PF 50V X7R 0402; Order Number: CGA2B3X7R1H103K050BD; Distributor: TDK Corporation; Package: 0402
C114 C116 = Tantalum Chip Capacitor: Order Number: T520C227M006ATE015; Value: CAP TANT POLY 220UF 6.3V 2312 15mOhm; Package: C; Distributor: KEMET
C118 C119 = Cap: Capacitor; Published: 8-Jun-2000; LatestRevisionDate: 17-Jul-2002; LatestRevisionNote: Re-released for DXP Platform.; PackageReference: RAD-0.3; Publisher: Altium Limited; PackageDescription: Radial Cap, Thru-Hole; 2 Leads; 0.3 in Pin Spacing
D100 = BAT54A: Schottky Barrier Double Diode; LatestRevisionNote: IPC-7351 Footprint Added.; Package: SOT23; PackageDescription: 3-Pin SOT-23 Package 0.95 mm Pitch, 2.3 mm Lead Span; ComponentLink1Description: Manufacturer Link; ComponentLink1URL: http://www.semiconductors.philips.com/; Value: NUP2105LT1G; Distributor: ON Semiconductor; Order Number: NUP2105LT1G
IC100 = STM32F405: STM32 ARM-based 32-bit MCU; Order Number: STM32F405RGT6; Value: STM32F405RGT6; Package: LQFP-64; Distributor: STMicroelectronics
IC102 = TPS7xx33: Value: LDO 3.3V 250mA; Order Number: TPS73233DBVT; Distributor: Texas Instruments; Package: SOT23-5
IC103 = PreciseRef: Value: Voltage reference 3.3V 0.5% 50ppm/C; Order Number: LT1460KCS3-3.3#TRMPBF; Distrubutor: Linear Technology; Package: SOT23
L100 = Choke: Order Number: EXC-34CG900U; Distributor: Panasonic; Value: CMC 100MA 2LN 90 OHM SMD; Package: 0805 (2012 Metric), 4 PC Pad
NT100 = Net tie
P100 = Header 4: Header, 4-Pin; LatestRevisionDate: 17-Jul-2002; LatestRevisionNote: Re-released for DXP Platform.; Publisher: Altium Limited
P101 = Header 3: Header, 3-Pin; LatestRevisionDate: 17-Jul-2002; LatestRevisionNote: Re-released for DXP Platform.; Publisher: Altium Limited
P102-P104 = MHDR1X2: Header, 2-Pin; LatestRevisionDate: 17-Jul-2002; LatestRevisionNote: Re-released for DXP Platform.; Publisher: Altium Limited
P105 = Header 2X2: Header, 2-Pin, Dual row; LatestRevisionDate: 17-Jul-2002; LatestRevisionNote: Re-released for DXP Platform.; Publisher: Altium Limited
Q100 Q101 = 2N7002: as Q301 on sheet PowerHalfBridge; Published: 17-Sep-2003; LatestRevisionDate: 12-Dec-2006; LatestRevisionNote: IPC-7351 Footprint Added.; DatasheetVersion: 27-Jul-2000; PackageVersion: May-1999; PackageReference: SOT23; Publisher: Altium Limited; PackageDescription: 3-Pin SOT-23 Package 0.95 mm Pitch, 2.3 mm Lead Span; ComponentLink1Description: Manufacturer Link; ComponentLink1URL: http://www.semiconductors.philips.com/; ComponentLink2Description: Datasheet; ComponentLink2URL: http://www.semiconductors.philips.com/acrobat/datasheets/2N7002_4.pdf
R100-R111 R113-R115 R118-R120 R123 = Res1: Resistor; Published: 8-Jun-2000; LatestRevisionDate: 17-Jul-2002; LatestRevisionNote: Re-released for DXP Platform.; PackageReference: AXIAL-0.3; Publisher: Altium Limited; PackageDescription: Axial Device, Thru-Hole; 2 Leads; 0.3 in Pin Spacing
R112 R116 R117 = SMD: Value: RES SMD 10K OHM 1% 1/10W 0603; Order Number: ERJ-3EKF1002V; Package: RESC1608X05N(0603); Distributor: Panasonic
R121 = SMD: Value: RES SMD 39K OHM 1% 1/10W 0603; Order Number: ERJ-3EKF3902V; Package: RESC1608X05N(0603); Distributor: Panasonic
R122 = SMD: Value: RES SMD 2.2K OHM 1% 1/10W 0603; Order Number: ERJ-3EKF2201V; Package: RESC1608X05N(0603); Distributor: Panasonic
U100 = LM78M05CDT/NOPB: 3-Terminal Positive Voltage Regulators, 3-pin TO-252, Pb-Free; Manufacturer: National Semiconductor; PackageTopMarking: NSUZXYTT*LM78M05*CDT; PowerWise: N; CompType: LDO IC; Published: 1-Mar-2010; DatasheetVersion: Aug-2005; PackageVersion: revD, Feb-2009; PackageReference: TD03B; Publisher: Altium Limited; PackageDescription: TO252, Molded, Jedec, 6.8 x 6.10 x 2.30mm Body, 3 Lead, 2.28mm Pitch, Surface Mount; Supplier 1: Digi-Key; Supplier Part Number 1: LM78M05CDT-ND; Supplier 2: Farnell; Supplier Part Number 2: 1469112; PartNumber: LM78M05CDT/NOPB; RoHS: Y; PinCount: 3; Code_JEDEC: TO-252-AA; ComponentLink1Description: LM78M05 Datasheet; ComponentLink1URL: http://www.national.com/ds/LM/LM78M05.pdf; ComponentLink2Description: LM78M05 Web Page; ComponentLink2URL: http://www.national.com/pf/LM/LM78M05.html; ComponentLink3Description: TD03B Package Page; ComponentLink3URL: http://www.national.com/packaging/folders/td03b.html
Z100 = Crystal_smd_with_caps: Value: CER RES 8.0000MHZ 22PF SMD; Order Number: AWSCR-8.00CV-T; Distributor: Abracon LLC; Package: 3-SMD, Non-Standard
IC101 = TCAN332GDCNT: Order Number: TCAN332GDCNT; Package: SOT23-8; Value: TCAN332GDCNT; Distributor: Texas Instruments
J100-J106 = Socket: LatestRevisionDate: 17-Jul-2002; LatestRevisionNote: Re-released for DXP Platform.; Publisher: Altium Limited

## Nets that join several sheets
_CTRL_GND: PowerHalfBridge (25 pins), DriverSPI (23 pins), Controller (36 pins)
1_H_CONTROL: DriverSPI (IC200.37), Controller (IC100.43)
1_L_CONTROL: DriverSPI (IC200.38), Controller (IC100.36)
2_L_CONTROL: DriverSPI (IC200.40), Controller (IC100.35)
3_L_CONTROL: DriverSPI (IC200.42), Controller (IC100.34)
_AGND: DriverSPI (C200.1 IC200.35), Controller (9 pins)
_REF: DriverSPI (C200.2 IC200.26), Controller (8 pins)
BRK: PowerHalfBridge (U300.3), Controller (IC100.29)
BUCK: PowerHalfBridge (U300.1), DriverSPI (C213.1 L201.2 R204.2), Controller (C111.1 C113.1 U100.1)
EN_GATE: DriverSPI (IC200.33), Controller (R103.1)
FAULT: DriverSPI (IC200.28), Controller (IC100.54)
NetC212_1: DriverSPI (5 pins), Controller (P105.4 R123.1)
NetIC100_9: PowerHalfBridge (R302.1 R303.1), Controller (IC100.9)
NetIC100_10: PowerHalfBridge (R300.1 R301.1), Controller (IC100.10)
NetIC100_11: PowerHalfBridge (R304.1 R305.1), Controller (IC100.11)
NetIC100_14: DriverSPI (IC200.23), Controller (IC100.14)
NetIC100_15: DriverSPI (IC200.24), Controller (IC100.15)
NetIC100_16: DriverSPI (IC200.25), Controller (IC100.16)
NetIC200_12: PowerHalfBridge (NT300.1), DriverSPI (IC200.12)
NetIC200_13: PowerHalfBridge (NT301.1), DriverSPI (IC200.13)
NetIC200_22: PowerHalfBridge (NT302.1), DriverSPI (IC200.22)
NetIC200_29: DriverSPI (IC200.29), Controller (R104.1)
NetIC200_39: DriverSPI (IC200.39), Controller (R100.1)
NetIC200_41: DriverSPI (IC200.41), Controller (R101.1)
PHASE_1: PowerHalfBridge (8 pins), DriverSPI (IC200.16)
PHASE_2: PowerHalfBridge (8 pins), DriverSPI (IC200.9)
PHASE_3: PowerHalfBridge (8 pins), DriverSPI (IC200.19)
PWR_EN: PowerHalfBridge (R306.2), Controller (IC100.58)
~{SPI_CS}: DriverSPI (IC200.32), Controller (IC100.50)
SPI_MOSI: DriverSPI (IC200.30), Controller (IC100.53)
SPI_SCK: DriverSPI (IC200.31), Controller (IC100.51)
UH_P: PowerHalfBridge (Q302.1), DriverSPI (IC200.17)
UL_N: PowerHalfBridge (6 pins), DriverSPI (IC200.14)
UL_P: PowerHalfBridge (Q303.1), DriverSPI (IC200.15)
VH_P: PowerHalfBridge (Q304.1), DriverSPI (IC200.8)
Vin: PowerHalfBridge (12 pins), DriverSPI (13 pins), Controller (R121.1)
VL_N: PowerHalfBridge (6 pins), DriverSPI (IC200.11)
VL_P: PowerHalfBridge (Q305.1), DriverSPI (IC200.10)
WH_P: PowerHalfBridge (Q306.1), DriverSPI (IC200.18)
WL_N: PowerHalfBridge (6 pins), DriverSPI (IC200.21)
WL_P: PowerHalfBridge (Q307.1), DriverSPI (IC200.20)